# EAGLE design ExtremeFeedbackDevice (EAGLE 8.7.1)
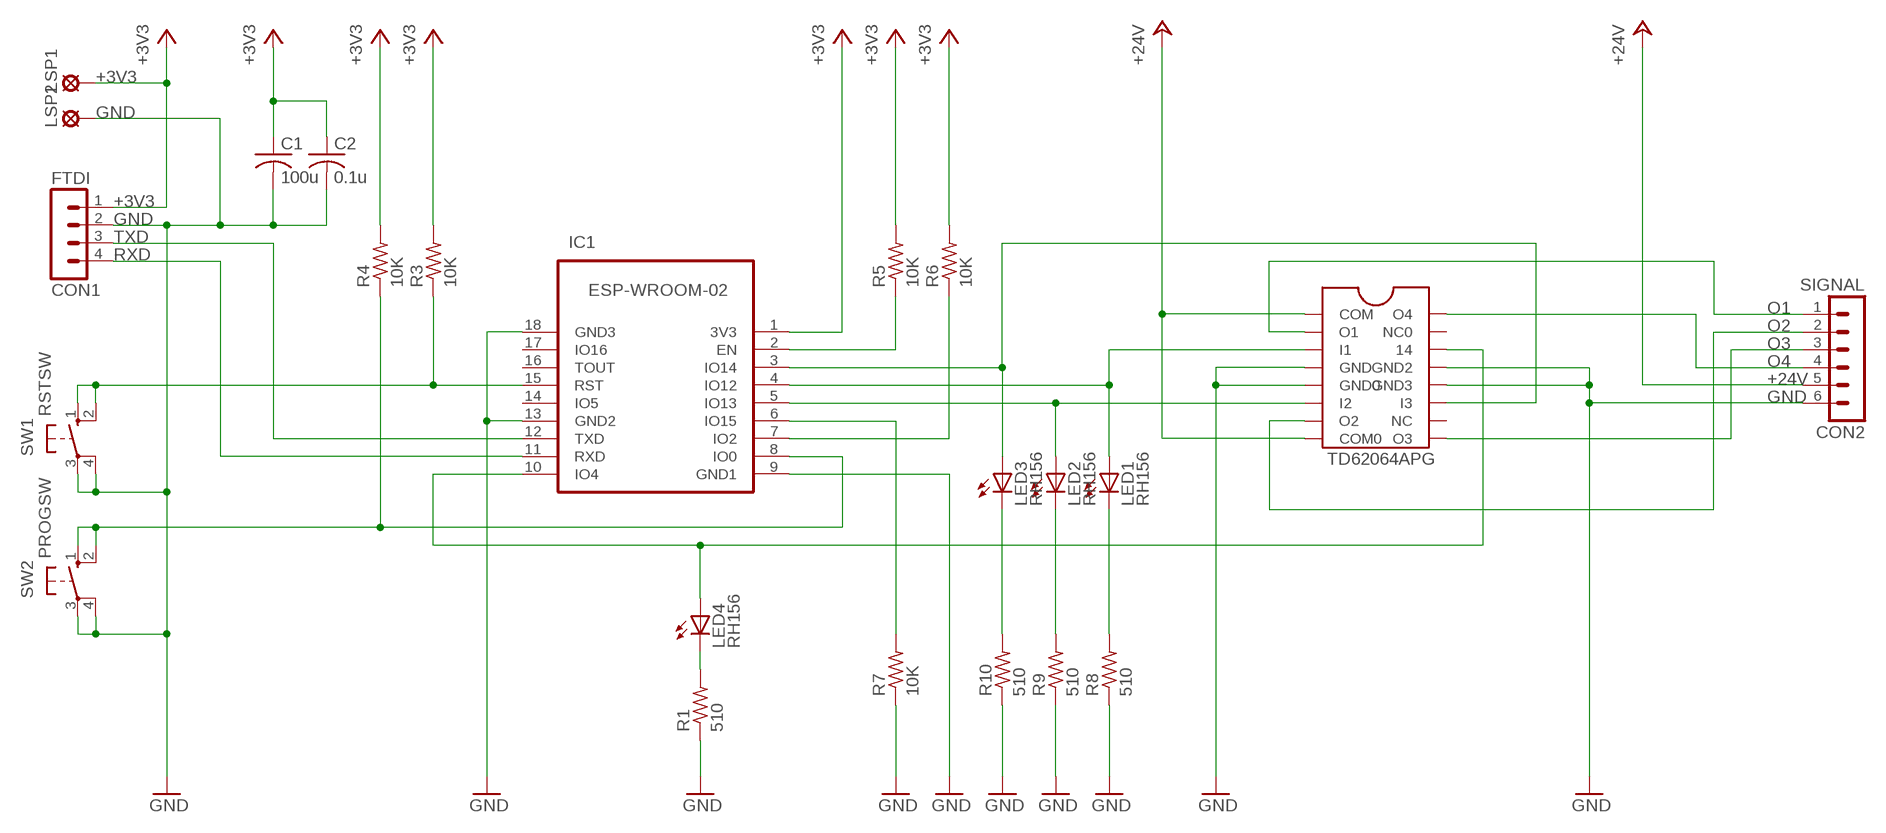
[diagram p0: schematic, sheet 1]

## Parts
C1  100u  C-US050-024X044  [C050-024X044]
C2  0.1u  C-US050-024X044  [C050-024X044]
CON1  FTDI  MA04-1  [MA04-1]
CON2  SIGNAL  MA06-1  [MA06-1]
IC1  ESP-WROOM-02  ESP-WROOM-02FRONT-FACE  [FRONT-FACE]
IC2  IC2  TD62064APG  [TD62064APG]
LED1  RH156  TLLR4400  [LED3MM]
LED2  RH156  TLLR4400  [LED3MM]
LED3  RH156  TLLR4400  [LED3MM]
LED4  RH156  TLLR4400  [LED3MM]
LSP1  LSP10  [LSP10]
LSP2  LSP10  [LSP10]
R1  510  R-US_0204/7  [0204/7]
R3  10K  R-US_0204/7  [0204/7]
R4  10K  R-US_0204/7  [0204/7]
R5  10K  R-US_0204/7  [0204/7]
R6  10K  R-US_0204/7  [0204/7]
R7  10K  R-US_0204/7  [0204/7]
R8  510  R-US_0204/7  [0204/7]
R9  510  R-US_0204/7  [0204/7]
R10  510  R-US_0204/7  [0204/7]
SW1  RSTSW  10-XX  [B3F-10XX]
SW2  PROGSW  10-XX  [B3F-10XX]

## Nets
+3V3: C1.1 C2.1 CON1.1 IC1.1(3V3) LSP1.MP R3.2 R4.2 R5.2 R6.2
+24V: CON2.5 IC2.1(COM) IC2.8(COM0)
GND: C1.2 C2.2 CON1.2 CON2.6 IC1.9(GND1) IC1.13(GND2) IC1.18(GND3) IC2.4(GND) IC2.5(GND0) IC2.12(GND3) IC2.13(GND2) LSP2.MP R1.1 R7.1 R8.1 R9.1 R10.1 SW1.3(P) SW1.4(P1) SW2.3(P) SW2.4(P1)
N$1: IC1.8(IO0) R4.1 SW2.1(S) SW2.2(S1)
N$2: IC1.5(IO13) IC2.6(I2) LED2.A
N$5: LED1.K(C) R8.2
N$6: LED2.K(C) R9.2
N$8: IC1.3(IO14) IC2.11(I3) LED3.A
N$9: IC1.4(IO12) IC2.3(I1) LED1.A
N$10: IC1.15(RST) R3.1 SW1.1(S) SW1.2(S1)
N$11: LED3.K(C) R10.2
N$13: IC1.2(EN) R5.1
N$14: IC1.7(IO2) R6.1
N$15: IC1.6(IO15) R7.2
N$16: IC1.10(IO4) IC2.14 LED4.A
N$17: LED4.K(C) R1.2
O1: CON2.1 IC2.2(O1)
O2: CON2.2 IC2.7(O2)
O3: CON2.3 IC2.9(O3)
O4: CON2.4 IC2.16(O4)
RXD: CON1.4 IC1.11(RXD)
TXD: CON1.3 IC1.12(TXD)
Unconnected: IC1.14(IO5) IC1.16(TOUT) IC1.17(IO16) IC2.10(NC) IC2.15(NC0)

## Library data of the parts
C1 C2 = PedestrianController:C-US: CAPACITOR, American symbol
CON1 = PedestrianController:MA04-1: PIN HEADER; OC_FARNELL: unknown; OC_NEWARK: unknown
CON2 = ExtremeFeedbackDevice:MA06-1: PIN HEADER; OC_FARNELL: unknown; OC_NEWARK: unknown
IC1 = PedestrianController:ESP-WROOM-02: WiFi module - ESP-WROOM-02
IC2 = ExtremeFeedbackDevice:TD62064APG: Dual In Line / Socket
LED1-LED4 = PedestrianController:TLLR4400: Low Current (2mA) LED 3 mm Tinted Diffused Package color RED Source: Data sheet <http://www.farnell.com/datasheets/391100.pdf>; MF: VISHAY SEMICONDUCTOR; OC_FARNELL: 1612437
LSP1 LSP2 = PedestrianController:LSP10: SOLDER PAD drill 1.0 mm, distributor Buerklin, 12H555
R1 R3-R9 = PedestrianController:R-US_: RESISTOR, American symbol
R10 = PedestrianController:R-US_: RESISTOR, American symbol; SPICEPREFIX: R
SW1 SW2 = PedestrianController:10-XX: OMRON SWITCH; MPN: B3F-1000; OC_FARNELL: 176432; OC_NEWARK: 36M3542

## Net classes
1 AC110V: width 1.524 mm, clearance 0.813 mm

## Board
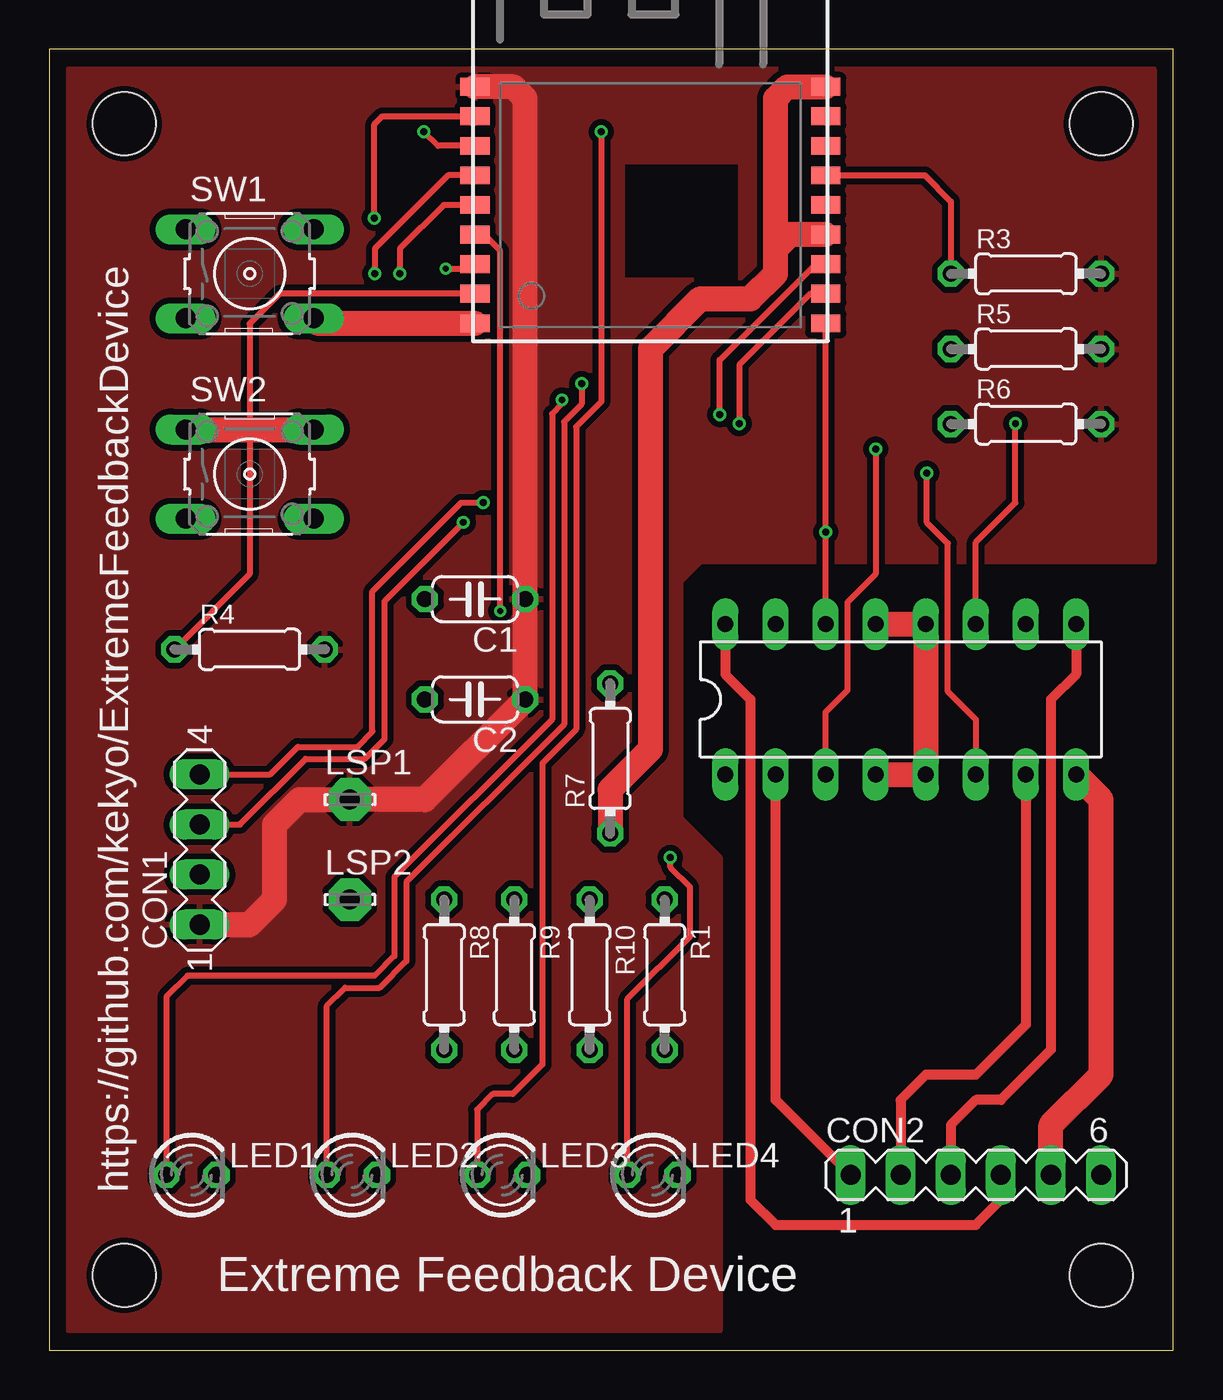
[diagram p1: board, top side]
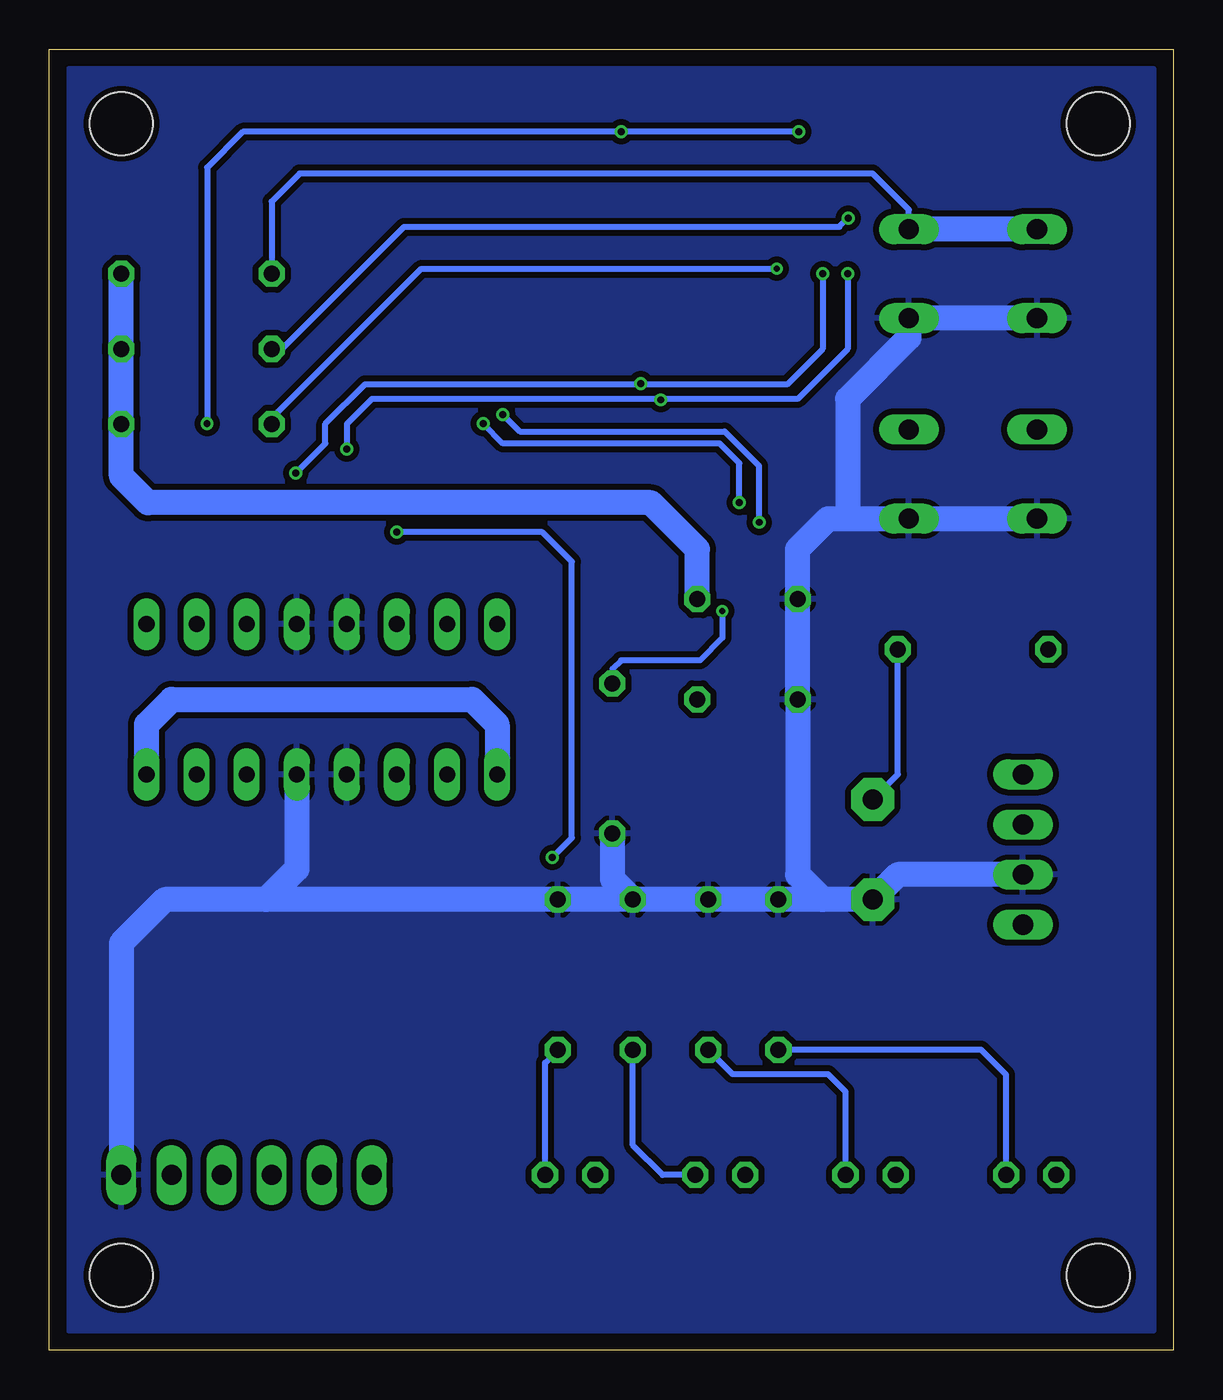
[diagram p2: board, bottom side, seen from below]

Size 57 x 66 mm. Coordinates in mm from the lower left corner, seen from the top.
Outline: 0,0 57,0 57,66 0,66 0,0
Copper layers (1*16): Top 0.035mm / dielectric 1.5mm / Bottom 0.035mm
Design rules "SeeedStudio_2layer_DRU_no_angle_20140221 *": minimum track width 12mil, minimum drill 12mil, track to track 12mil, track to pad 12mil, pad to pad 12mil, via to via 12mil, smd to smd 0mil, copper to edge 12mil, drill to drill 12mil, minimum pad ring 10mil, minimum via ring 6mil, stop-mask expansion 2mil, vias tented up to drill 100mil, thermal gap 10mil
Holes 3.2 mm at 3.81,62.23 53.34,62.23 53.34,3.81 3.81,3.81

### Footprints (pad centres in the part's own frame; a part is rotated, then mirrored left to right if it is on the bottom)
C050-024X044 = drill 0.813 octagon: 1 -2.54,0; 2 2.54,0
MA04-1 = drill 1.016 long: 1 -3.81,0; 2 -1.27,0; 3 1.27,0; 4 3.81,0
MA06-1 = drill 1.016 long: 1 -6.35,0; 2 -3.81,0; 3 -1.27,0; 4 1.27,0; 5 3.81,0; 6 6.35,0
FRONT-FACE = smd 1.485 x 0.9: 1 -8.893,4.9; 2 -8.893,3.4; 3 -8.893,1.9; 4 -8.893,0.4; 5 -8.893,-1.1; 6 -8.893,-2.6; 7 -8.893,-4.1; 8 -8.893,-5.6; 9 -8.893,-7.1; 10 8.893,-7.1; 11 8.893,-5.6; 12 8.893,-4.1; 13 8.893,-2.6; 14 8.893,-1.1; 15 8.893,0.4; 16 8.893,1.9; 17 8.893,3.4; 18 8.893,4.9
TD62064APG = drill 0.813 long: 1 -8.89,-3.81; 2 -6.35,-3.81; 3 -3.81,-3.81; 4 -1.27,-3.81; 5 1.27,-3.81; 6 3.81,-3.81; 7 6.35,-3.81; 8 8.89,-3.81; 9 8.89,3.81; 10 6.35,3.81; 11 3.81,3.81; 12 1.27,3.81; 13 -1.27,3.81; 14 -3.81,3.81; 15 -6.35,3.81; 16 -8.89,3.81
LED3MM = drill 0.813 octagon: A -1.27,0; K 1.27,0
LSP10 = drill 1.016 pad 2.159 octagon: MP 0,0
0204/7 = drill 0.813 octagon: 1 -3.81,0; 2 3.81,0
B3F-10XX = drill 1.016 long: 1 -3.251,2.261; 2 3.251,2.261; 3 -3.251,-2.261; 4 3.251,-2.261

### Placement (x,y rotation side)
C1  21.59,38.1 180 top
C2  21.59,33.02 180 top
CON1  7.62,25.4 90 top
CON2  46.99,8.89 0 top
IC1  30.48,59.2 0 top
IC2  43.18,33.02 0 top
LED1  7.21,8.89 0 top
LED2  15.35,8.89 0 top
LED3  22.97,8.89 0 top
LED4  30.59,8.89 0 top
LSP1  15.24,27.94 0 top
LSP2  15.24,22.86 0 top
R1  31.21,19.05 270 top
R3  49.53,54.61 0 top
R4  10.16,35.56 0 top
R5  49.53,50.8 0 top
R6  49.53,46.99 0 top
R7  28.44,30.02 90 top
R8  20.02,19.05 270 top
R9  23.59,19.05 270 top
R10  27.4,19.05 270 top
SW1  10.16,54.61 0 top
SW2  10.16,44.45 0 top

### Tracks (layer width: path | path; a pad name or v marks a point on that pad's centre or on a via)
+3V3
  Top 0.305: 12.8,28.35 12.7,27.94
  Top 1.27: CON1.1 10.16,21.59 11.43,22.86 11.43,26.67 12.7,27.94 LSP1.MP 19.05,27.94 C2.1 C1.1 24.13,63.5 23.53,64.1 IC1.1
  Bottom 0.305: LSP1.MP 13.97,29.21 R4.2
  Bottom 1.27: C1.1 24.13,40.64 26.49,43 52,43 53.34,44.34 R6.2 R5.2 R3.2
  pour Top: 1,65 56,65 56,40 33,40 32,39 32,27 34,25 34,1 1,1 1,64
+24V
  Top 1.27: CON2.5 50.8,11.43 53.34,13.97 53.34,27.94 IC2.8
  Bottom 1.27: IC2.8 52.07,31.75 50.8,33.02 35.56,33.02 34.29,31.75 IC2.1
GND
  Top 1.27: SW1.4 13.66,52.1 IC1.9 | 36.83,55.88 36.83,54.61 35.56,53.34 33.02,53.34 30.48,50.8 30.48,30.48 28.44,28.44 R7.1 | 36.83,55.88 36.83,63.5 37.43,64.1 IC1.18 | IC1.13 37.55,56.6 36.83,55.88 | IC2.4 IC2.5 IC2.12 IC2.13
  Bottom 1.27: CON1.2 13.97,24.13 LSP2.MP 17.78,22.86 | 17.78,22.86 19.05,24.13 C2.2 C1.2 19.05,40.64 17.5,42.19 16.51,42.19 | 16.51,42.19 SW2.4 SW2.3 | SW1.3 SW1.4 13.41,51.36 16.51,48.26 16.51,42.19 | R10.1 R1.1 46,22.86 | 17.78,22.86 R8.1 R9.1 R10.1 | 46,22.86 51.14,22.86 53.34,20.66 CON2.6 | IC2.5 44.45,24.41 46,22.86 | R7.1 28.44,23.9 R10.1
  pour Bottom: 1,65 56,65 56,1 1,1 1,64
N$1
  Top 0.305: R4.1 10.16,39.37 10.16,46.71 10.16,52.07 11.69,53.6 IC1.8 | 9.17,46.71 SW2.1
  Top 1.27: SW2.1 10.16,46.71 SW2.2
N$2  (via drill 0.35)
  Top 0.305: IC1.5 20,58.1 17.78,55.88 v17.78,54.61 | IC2.6 46.99,31.99 45.57,33.41 45.57,40.93 44.5,42 v44.5,44.5 | v27,49.05 27,48 26.11,47.11 26.11,31.75 18.11,23.75 18.11,19.75 16.75,18.39 15,18.39 14.08,17.47 LED2.A
  Bottom 0.305: v17.78,54.61 17.78,50.8 19.58,49 27,49 | 27,49 41,49 43,47 43,46 v44.5,44.5 | v27,49.05 27,49
N$5
  Bottom 0.305: LED1.K 8.48,13.98 9.74,15.24 R8.2
N$6
  Bottom 0.305: LED2.K 16.62,13.12 17.5,14 22.35,14 R9.2
N$8  (via drill 0.35)
  Top 0.305: IC1.3 19.71,61.1 v19,61.81 | v28,61.81 28,48.14 26.72,46.86 26.72,31.5 25,29.78 25,14.5 23.5,13 22.5,13 21.7,12.2 LED3.A | IC2.11 46.99,40.99 49,43 v49,47
  Bottom 0.305: v19,61.81 v28,61.81 47.19,61.81 49,60 v49,47
N$9  (via drill 0.35)
  Top 0.305: 21.34,59.44 IC1.4 20.23,59.6 16.51,55.88 v16.51,54.61 | v41.91,45.72 41.91,39.37 40.49,37.95 40.49,33.49 39.37,32.37 IC2.3 | v26,48.22 26,48 25.5,47.5 25.5,32 17.5,24 17.5,20 16.5,19 7,19 5.94,17.94 LED1.A
  Bottom 0.305: v16.51,54.61 16.51,50.8 19.05,48.26 26,48.26 | 26,48.26 40.64,48.26 41.91,46.99 v41.91,45.72 | 26,48.26 v26,48.22
N$10
  Top 0.305: IC1.15 44.4,59.6 45.72,58.28 R3.1
  Bottom 0.305: SW1.2 13.41,57.86 15.24,59.69 44.31,59.69 45.72,58.28 R3.1
  Bottom 1.27: SW1.1 SW1.2
N$11
  Bottom 0.305: LED3.K 25.89,8.89 27.4,10.4 R10.2
N$13  (via drill 0.35)
  Top 0.305: v16.49,57.44 16.49,62.21 16.88,62.6 IC1.2
  Bottom 0.305: R5.1 45.2,50.8 39,57 16.93,57 v16.49,57.44
N$14  (via drill 0.3)
  Top 0.305: v20.12,54.86 21.34,54.86 IC1.7
  Bottom 0.305: R6.1 45.72,47.28 38.14,54.86 v20.12,54.86
N$15  (via drill 0.3)
  Top 0.305: v22.86,37.49 22.86,55.78 22.25,56.39 21.64,56.39 IC1.6
  Bottom 0.305: v22.86,37.49 22.86,36.14 24,35 28,35 28.44,34.56 R7.2
N$16  (via drill 0.35)
  Top 0.305: IC2.14 v39.37,41.5 IC1.10 | LED4.A 29.32,17.82 32.5,21 32.5,23.5 31.5,24.5 v31.5,25
  Bottom 0.305: v39.37,41.5 32,41.5 30.5,40 30.5,26 v31.5,25
N$17
  Bottom 0.305: LED4.K 31.86,14.59 R1.2
O1
  Top 0.508: CON2.1 36.83,12.7 IC2.2
O2
  Top 0.508: IC2.7 49.53,16.51 46.99,13.97 44.45,13.97 43.18,12.7 CON2.2
O3
  Top 0.508: IC2.9 52.07,34.29 50.8,33.02 50.8,15.24 48.26,12.7 46.99,12.7 45.72,11.43 CON2.3
O4
  Top 0.508: IC2.16 34.29,34.29 35.56,33.02 35.56,7.62 36.83,6.35 46.99,6.35 48.26,7.62 CON2.4
RXD  (via drill 0.35)
  Top 0.305: IC1.11 38.6,53.6 35,50 v35,47 | CON1.4 11.21,29.21 12.61,30.61 15.61,30.61 16.39,31.39 16.39,38.5 20.89,43 v22,43
  Bottom 0.305: v35,47 34,46 23,46 22,45 v22,43
TXD  (via drill 0.35)
  Top 0.305: v34,47.48 34,50.23 38.87,55.1 IC1.12 | CON1.3 9.67,26.67 13,30 16,30 17,31 17,38 v21,42
  Bottom 0.305: v34,47.48 33.13,46.61 22.75,46.61 21,44.86 v21,42

### Text on the board
tPlace: https://github.com/kekyo/ExtremeFeedbackDevice | Extreme Feedback Device